# EAGLE design deska (EAGLE 6.5.0)
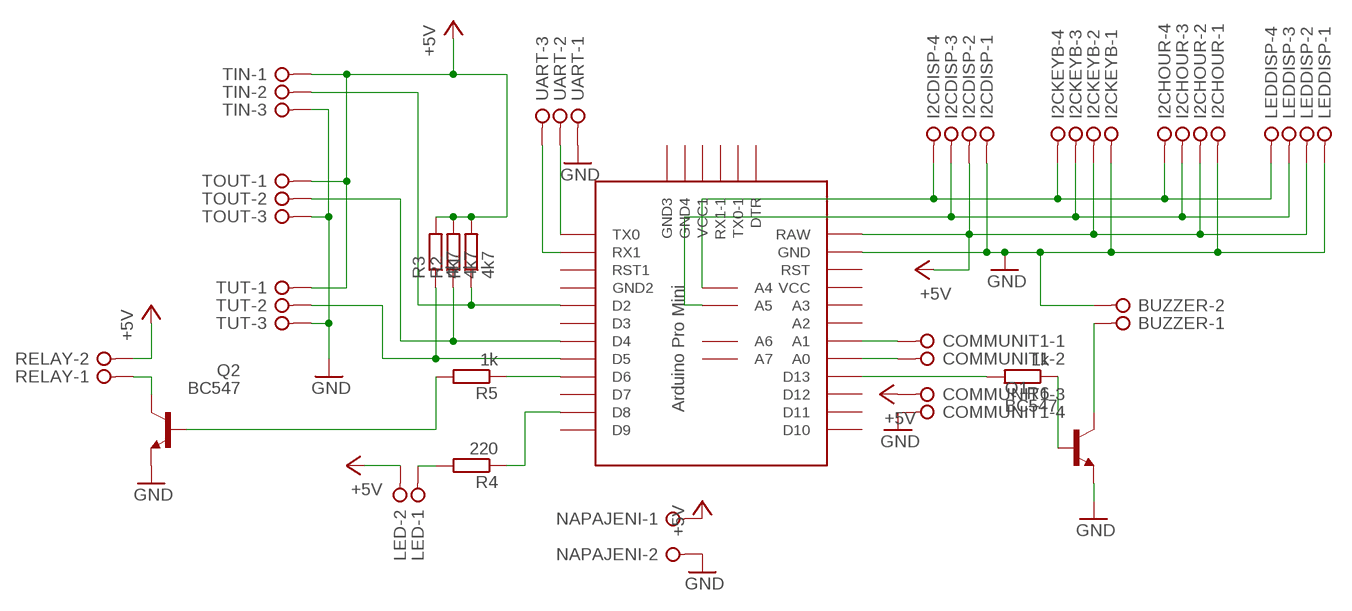
[diagram p0: schematic, sheet 1]

## Parts
BUZZER  W237-02P  [W237-132]
COMMUNIT1  W237-04P  [W237-4P]
I2CDISP  W237-04P  [W237-4P]
I2CHOUR  W237-04P  [W237-4P]
I2CKEYB  W237-04P  [W237-4P]
LED  W237-02P  [W237-132]
LEDDISP  W237-04P  [W237-4P]
NAPAJENI  W237-02P  [W237-132]
Q1  BC547  [TO92]
Q2  BC547  [TO92]
R1  4k7  R-EU_0207/7  [0207/7]
R2  4k7  R-EU_0207/7  [0207/7]
R3  4k7  R-EU_0207/7  [0207/7]
R4  220  R-EU_0207/7  [0207/7]
R5  1k  R-EU_0207/7  [0207/7]
R6  1k  R-EU_0207/7  [0207/7]
RELAY  W237-02P  [W237-132]
TIN  W237-3E  [W237-3E]
TOUT  W237-3E  [W237-3E]
TUT  W237-3E  [W237-3E]
U$1  PRO-MINI-2  [PRO-MINI-2]
UART  W237-3E  [W237-3E]

## Nets
+5V: COMMUNIT1.3 I2CDISP.2 I2CHOUR.2 I2CKEYB.2 LED.2 LEDDISP.2 NAPAJENI.1 R1.2 R2.2 R3.2 RELAY.2 TIN.1 TOUT.1 TUT.1 U$1.RAW
GND: BUZZER.2 COMMUNIT1.4 I2CDISP.1 I2CHOUR.1 I2CKEYB.1 LEDDISP.1 NAPAJENI.2 Q1.1(E) Q2.1(E) TIN.3 TOUT.3 TUT.3 U$1.GND UART.1
N$1: R1.1 TIN.2 U$1.D2
N$2: R2.1 TOUT.2 U$1.D4
N$3: R3.1 TUT.2 U$1.D5
N$4: R5.1 U$1.D6
N$5: R4.1 U$1.D8
N$6: LED.1 R4.2
N$7: Q1.2(B) R6.1
N$8: COMMUNIT1.1 U$1.A1
N$9: U$1.TX0 UART.2
N$10: U$1.RX1 UART.3
N$11: I2CDISP.4 I2CHOUR.4 I2CKEYB.4 LEDDISP.4 U$1.A4
N$12: I2CDISP.3 I2CHOUR.3 I2CKEYB.3 LEDDISP.3 U$1.A5
N$13: Q2.2(B) R5.2
N$14: Q2.3(C) RELAY.1
N$15: BUZZER.1 Q1.3(C)
N$16: R6.2 U$1.D13
N$17: COMMUNIT1.2 U$1.A0
Unconnected: U$1.A2 U$1.A3 U$1.A6 U$1.A7 U$1.D3 U$1.D7 U$1.D9 U$1.D10 U$1.D11 U$1.D12 U$1.DTR U$1.GND1(GND2) U$1.GND2(GND3) U$1.GND3(GND4) U$1.RST U$1.RST1 U$1.RX1-1 U$1.TX0-1 U$1.VCC U$1.VCC1

## Library data of the parts
BUZZER LED NAPAJENI RELAY = con-wago-508:W237-02P: WAGO SREW CLAMP; OC_FARNELL: unknown; OC_NEWARK: unknown
COMMUNIT1 I2CDISP I2CHOUR I2CKEYB LEDDISP = con-wago-508:W237-04P: WAGO SREW CLAMP; OC_FARNELL: unknown; OC_NEWARK: unknown
Q1 Q2 = transistor-npn:BC547*: NPN Transistor
R1-R6 = rcl:R-EU_: RESISTOR, European symbol
TIN TOUT TUT UART = con-wago-508:W237-3E: WAGO SREW CLAMP; OC_FARNELL: unknown; OC_NEWARK: unknown
U$1 = Arduino-clone:PRO-MINI-2: Arduino Pro Mini Layout 2 Sparkfun.com

## Board
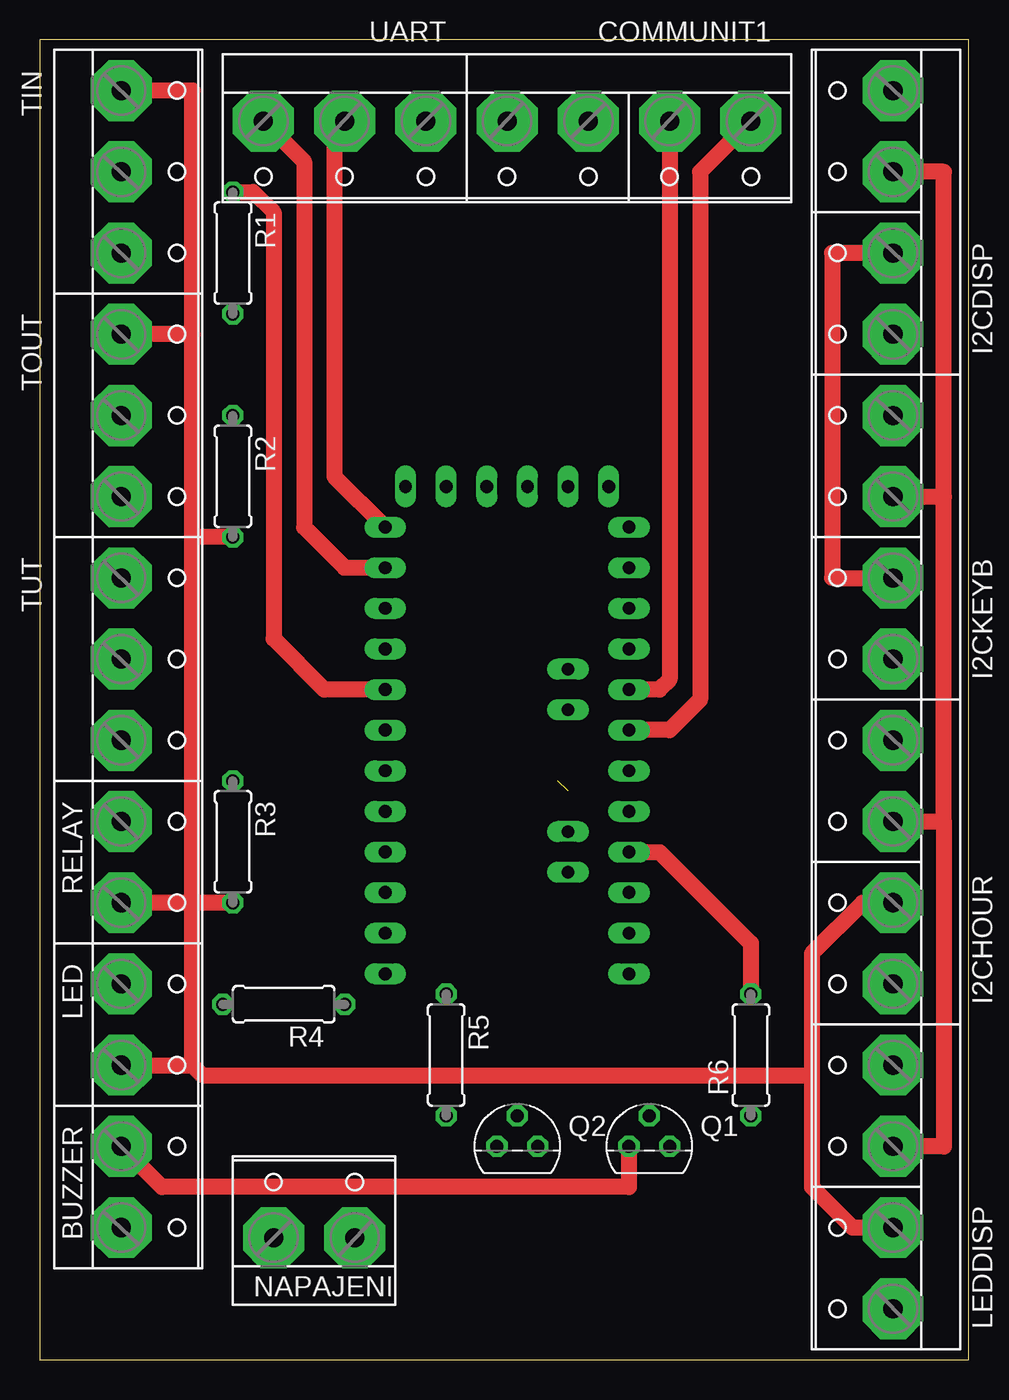
[diagram p1: board, top side]
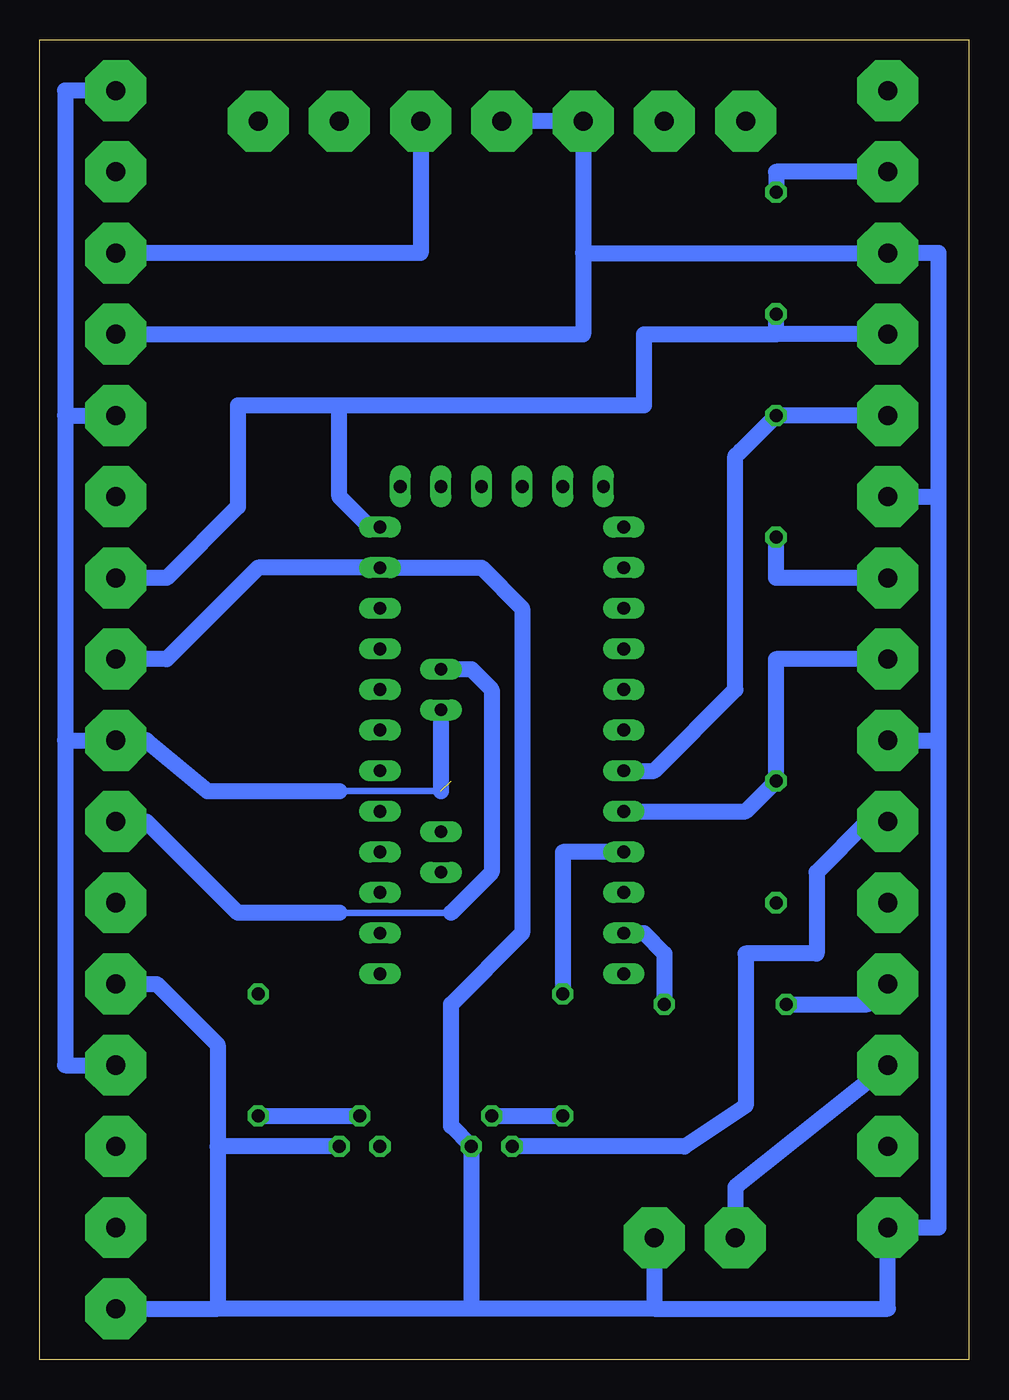
[diagram p2: board, bottom side, seen from below]

Size 58.09 x 82.54 mm. Coordinates in mm from the lower left corner, seen from the top.
Outline: 0,0 58.09,0 58.09,82.54 0,82.54 0,0
Copper layers (1*16): Top 0.035mm / dielectric 1.5mm / Bottom 0.035mm
Design rules "default": minimum track width 10mil, minimum drill 24mil, track to track 8mil, track to pad 8mil, pad to pad 8mil, via to via 8mil, smd to smd 8mil, copper to edge 40mil, drill to drill 8mil, minimum pad ring 10mil, minimum via ring 8mil, stop-mask expansion 4mil, vias tented up to drill 0mil, thermal gap 10mil

### Footprints (pad centres in the part's own frame; a part is rotated, then mirrored left to right if it is on the bottom)
W237-132 = drill 1.194 pad 3.81 octagon: 1 -2.54,-0.635; 2 2.54,-0.635
W237-4P = drill 1.194 pad 3.81 octagon: 1 -7.62,-0.635; 2 -2.54,-0.635; 3 2.54,-0.635; 4 7.62,-0.635
TO92 = drill 0.813 octagon: 1 1.27,0; 2 0,1.905; 3 -1.27,0
0207/7 = drill 0.813 octagon: 1 -3.81,0; 2 3.81,0
W237-3E = drill 1.194 pad 3.81 octagon: 1 -5.08,-0.635; 2 0,-0.635; 3 5.08,-0.635
PRO-MINI-2 = drill 0.8 long: A0 6.35,2.54; A1 6.35,0; A2 6.35,-2.54; A3 6.35,-5.08; A4 2.54,1.27; A5 2.54,3.81; A6 2.54,-8.89; A7 2.54,-6.35; D2 -8.89,2.54; D3 -8.89,0; D4 -8.89,-2.54; D5 -8.89,-5.08; D6 -8.89,-7.62; D7 -8.89,-10.16; D8 -8.89,-12.7; D9 -8.89,-15.24; D10 6.35,-15.24; D11 6.35,-12.7; D12 6.35,-10.16; D13 6.35,-7.62; DTR 5.08,15.24; GND 6.35,10.16; GND1 -8.89,5.08; GND2 -7.62,15.24; GND3 -5.08,15.24; RAW 6.35,12.7; RST 6.35,7.62; RST1 -8.89,7.62; RX1 -8.89,10.16; RX1-1 0,15.24; TX0 -8.89,12.7; TX0-1 2.54,15.24; VCC 6.35,5.08; VCC1 -2.54,15.24

### Placement (x,y rotation side)
BUZZER  5.71,10.79 270 top
COMMUNIT1  36.83,76.83 180 top
I2CDISP  52.7,71.75 90 top
I2CHOUR  52.7,31.11 90 top
I2CKEYB  52.7,51.44 90 top
LED  5.71,20.95 270 top
LEDDISP  52.7,10.79 90 top
NAPAJENI  17.14,8.26 0 top
Q1  38.1,13.34 0 top
Q2  29.84,13.34 0 top
R1  12.07,69.22 270 top
R2  12.07,55.24 270 top
R3  12.07,32.38 270 top
R4  15.24,22.23 180 top
R5  25.4,19.05 270 top
R6  44.45,19.05 90 top
RELAY  5.71,31.11 270 top
TIN  5.71,74.3 270 top
TOUT  5.71,59.05 270 top
TUT  5.71,43.81 270 top
U$1  30.48,39.37 0 top
UART  19.05,76.83 180 top

### Tracks (layer width: path | path; a pad name or v marks a point on that pad's centre or on a via)
+5V
  Top 1.016: LED.2 9.53,18.41 | 9.53,64.14 TOUT.1 | R2.2 9.53,51.44 | 9.53,51.44 9.53,64.14 | 9.53,28.57 9.53,51.44 | 9.53,64.14 9.53,79.38 TIN.1 | 48.26,17.78 10.16,17.78 9.53,18.41 | I2CDISP.2 49.53,69.22 49.53,48.9 I2CKEYB.2 | R3.2 9.53,28.57 | 9.53,28.57 RELAY.2 | 9.53,18.41 9.53,28.57 | I2CHOUR.2 51.44,28.57 48.26,25.4 48.26,17.78 | 48.26,17.78 48.26,10.79 50.8,8.26 LEDDISP.2
  Bottom 1.016: TOUT.1 12.07,64.14 | 12.07,64.14 R1.2 | TUT.1 12.07,48.9 R2.2 | 39.37,59.69 45.72,59.69 45.72,53.34 50.16,48.9 I2CKEYB.2 | 39.37,59.69 20.32,59.69 20.32,64.14 12.07,64.14 | NAPAJENI.1 14.61,10.79 LED.2 | COMMUNIT1.3 34.29,69.22 I2CDISP.2 | U$1.RAW 37.46,52.07 39.37,53.98 39.37,59.69
GND
  Bottom 1.016: I2CDISP.1 24.13,64.14 24.13,69.22 | 24.13,69.22 TIN.3 1.91,69.22 1.91,53.98 | 19.68,3.17 31.12,3.17 | 31.12,3.17 46.99,3.17 | 1.91,38.73 1.91,8.26 BUZZER.2 5.08,3.17 19.68,3.17 | TUT.3 1.91,38.73 | 1.91,38.73 1.91,53.98 | TOUT.3 1.91,53.98 | COMMUNIT1.4 UART.1 24.13,69.22 | NAPAJENI.2 19.68,3.17 | I2CHOUR.1 50.8,23.5 46.99,19.68 46.99,13.34 | 46.99,13.34 46.99,3.17 | LEDDISP.1 46.99,3.17 | Q1.1 46.99,13.34 | 31.12,3.17 Q2.1 32.38,14.61 32.38,22.23 27.94,26.67 27.94,46.99 30.48,49.53 U$1.GND 44.45,49.53 50.16,43.81 I2CKEYB.1
N$1
  Top 1.016: R1.1 13.34,73.03 14.61,71.75 14.61,45.09 17.78,41.91 U$1.D2
  Bottom 1.016: TIN.2 12.07,74.3 R1.1
N$2
  Bottom 1.016: TOUT.2 R2.1 14.29,56.83 14.61,56.52 14.61,41.91 19.68,36.83 U$1.D4
N$3
  Bottom 1.016: TUT.2 12.07,43.81 R3.1 13.97,34.29 U$1.D5
N$4
  Bottom 1.016: U$1.D6 25.4,31.75 R5.1
N$5
  Bottom 1.016: U$1.D8 20.32,26.67 19.05,25.4 R4.1
N$6
  Bottom 1.016: R4.2 6.35,22.23 LED.1
N$7
  Bottom 1.016: R6.1 Q1.2
N$8
  Top 1.016: COMMUNIT1.1 41.27,74.3 41.27,41.27 39.37,39.37 U$1.A1 36.2,39.37
N$9
  Top 1.016: UART.2 18.41,76.2 18.41,55.24 U$1.TX0
N$10
  Top 1.016: UART.3 16.51,74.93 16.51,52.07 19.05,49.53 U$1.RX1
N$11  (1 unrouted)
  Bottom 0.406: 39.37,35.56 33.02,35.56
  Bottom 1.016: I2CDISP.4 56.52,79.38 56.52,59.05 | 56.52,59.05 I2CKEYB.4 | 56.52,59.05 56.52,38.73 | 56.52,38.73 I2CHOUR.4 51.44,38.73 47.62,35.56 39.37,35.56 | 56.52,38.73 56.52,18.41 LEDDISP.4 | U$1.A4 33.02,35.56
N$12
  Top 1.016: 56.52,33.66 56.52,13.34 LEDDISP.3 | I2CHOUR.3 56.52,33.66 | 56.52,33.66 56.52,53.98 | I2CKEYB.3 56.52,53.98 | 56.52,53.98 56.52,74.3 I2CDISP.3
  Bottom 0.406: 32.38,27.94 39.37,27.94
  Bottom 1.016: I2CHOUR.3 51.44,33.66 45.72,27.94 39.37,27.94 | 32.38,27.94 29.84,30.48 29.84,41.91 31.12,43.18 U$1.A5
N$13
  Bottom 1.016: Q2.2 R5.2
N$14
  Bottom 1.016: RELAY.1 6.35,33.66 9.53,30.48 9.53,25.4 13.97,25.4 13.97,15.88 17.78,13.34 Q2.3
N$15
  Top 1.016: Q1.3 36.83,10.79 7.62,10.79 BUZZER.1
N$16
  Top 1.016: U$1.D13 38.73,31.75 44.45,26.04 R6.2
N$17
  Top 1.016: COMMUNIT1.2 39.37,42.55 38.73,41.91 U$1.A0